# Altium schematic sheet 8500_ADC_Y.SchDoc
size A4
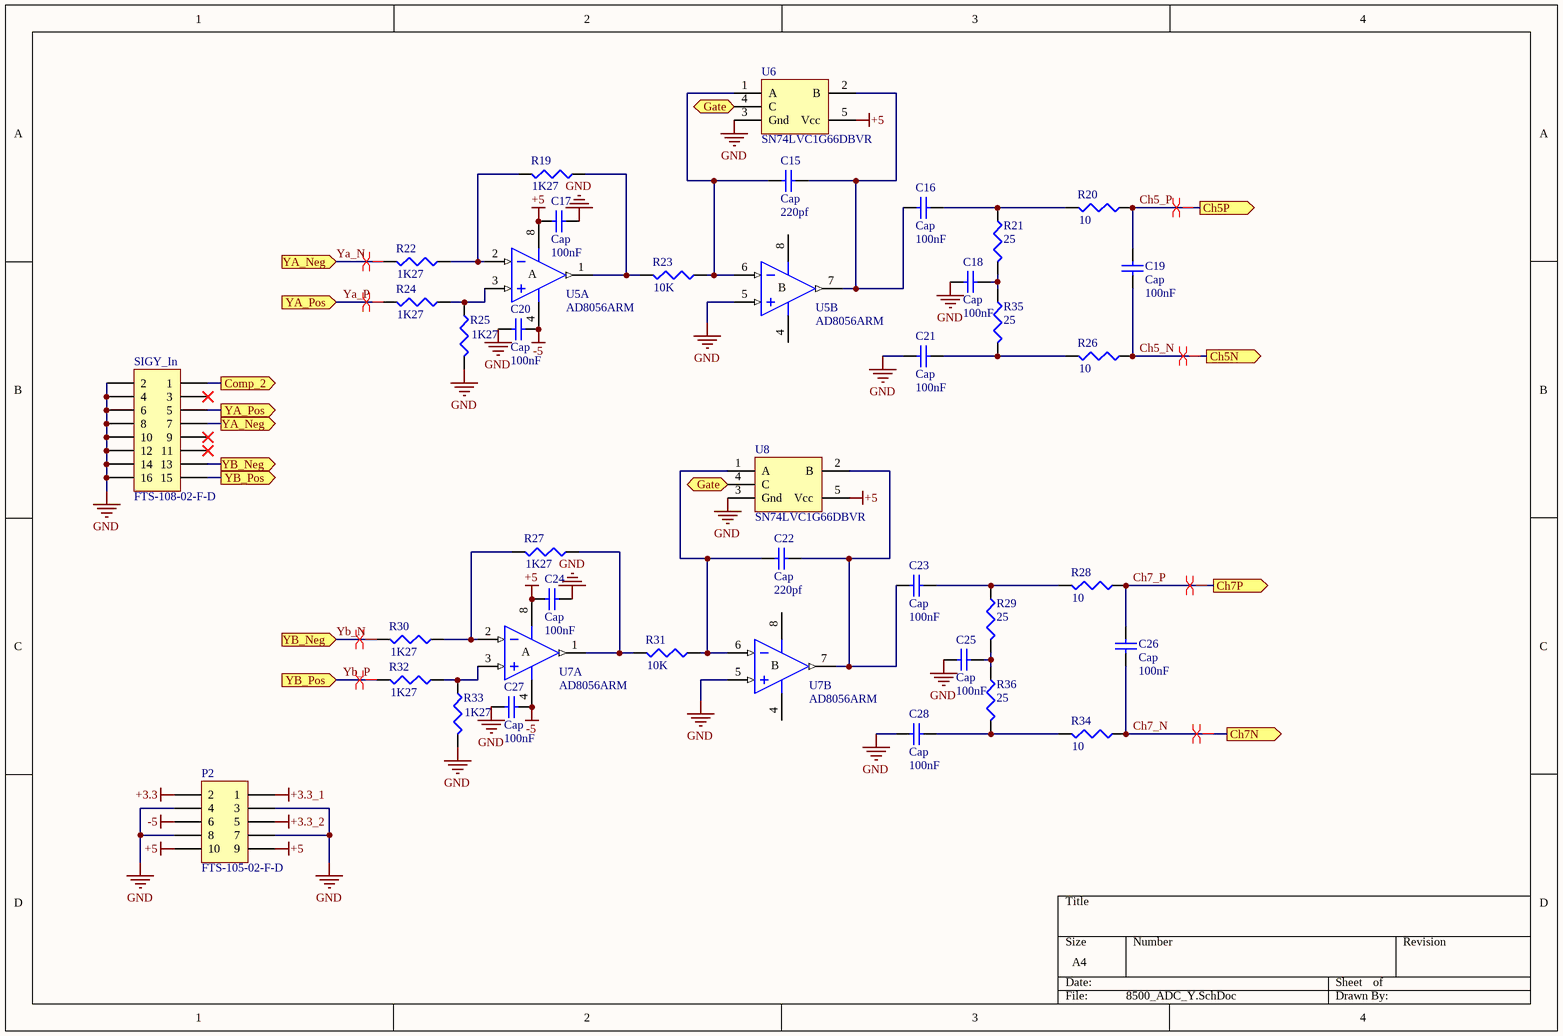
[diagram p0: 8500_ADC_Y.SchDoc]

## Parts
C15  Cap  value 220pf  [0402]
C16  Cap  value 100nF  [0402]
C17  Cap  value 100nF  [0402]
C18  Cap  value 100nF  [0402]
C19  Cap  value 100nF  [0402]
C20  Cap  value 100nF  [0402]
C21  Cap  value 100nF  [0402]
C22  Cap  value 220pf  [0402]
C23  Cap  value 100nF  [0402]
C24  Cap  value 100nF  [0402]
C25  Cap  value 100nF  [0402]
C26  Cap  value 100nF  [0402]
C27  Cap  value 100nF  [0402]
C28  Cap  value 100nF  [0402]
P2  FTS-105-02-F-D  [MHDR2X5]
R19  value 1K27  [0402]  (hidden comment: Res3)
R20  value 10  [0402]  (hidden comment: Res3)
R21  value 25  [0402]  (hidden comment: Res3)
R22  value 1K27  [0402]  (hidden comment: Res3)
R23  value 10K  [0402]  (hidden comment: Res3)
R24  value 1K27  [0402]  (hidden comment: Res3)
R25  value 1K27  [0402]  (hidden comment: Res3)
R26  value 10  [0402]  (hidden comment: Res3)
R27  value 1K27  [0402]  (hidden comment: Res3)
R28  value 10  [0402]  (hidden comment: Res3)
R29  value 25  [0402]  (hidden comment: Res3)
R30  value 1K27  [0402]  (hidden comment: Res3)
R31  value 10K  [0402]  (hidden comment: Res3)
R32  value 1K27  [0402]  (hidden comment: Res3)
R33  value 1K27  [0402]  (hidden comment: Res3)
R34  value 10  [0402]  (hidden comment: Res3)
R35  value 25  [0402]  (hidden comment: Res3)
R36  value 25  [0402]  (hidden comment: Res3)
SIGY_In  FTS-108-02-F-D  [MHDR2X8]
U5  AD8056ARM  [RM-8]  (parts A,B of 2)
U6  SN74LVC1G66DBVR  [SOT23-5]
U7  AD8056ARM  [RM-8]  (parts A,B of 2)
U8  SN74LVC1G66DBVR  [SOT23-5]

## Ports
Ch5N (out), Ch5P (out), Ch7N (out), Ch7P (out), Comp_2 (out), Gate (out), YA_Neg (in), YA_Neg (out), YA_Pos (in), YA_Pos (out), YB_Neg (in), YB_Neg (out), YB_Pos (in), YB_Pos (out)

## Nets
+3.3: P2.2
+3.3_1: P2.1
+3.3_2: P2.5
+5: C17.1 C24.1 P2.9 P2.10 U5.8(V+) U6.5(Vcc) U7.8(V+) U8.5(Vcc)
-5: C20.2 C27.2 P2.6 U5.4(V-) U7.4(V-)
GND: C17.2 C18.1 C20.1 C21.1 C24.2 C25.1 C27.1 C28.1 P2.3 P2.4 P2.7 P2.8 R25.2 R33.2 SIGY_In.2 SIGY_In.4 SIGY_In.6 SIGY_In.8 SIGY_In.10 SIGY_In.12 SIGY_In.14 SIGY_In.16 U5.5(IN+) U6.3(Gnd) U7.5(IN+) U8.3(Gnd)
Ch5_N: C19.1 R26.1 ; port Ch5N
Ch5_P: C19.2 R20.1 ; port Ch5P
Ch7_N: C26.1 R34.1 ; port Ch7N
Ch7_P: C26.2 R28.1 ; port Ch7P
Comp_2: SIGY_In.1 ; port Comp_2
Gate: U6.4(C) U8.4(C) ; port Gate
Ya_N: R22.2 SIGY_In.7 ; port YA_Neg
Ya_P: R24.2 SIGY_In.5 ; port YA_Pos
Yb_N: R30.2 SIGY_In.13 ; port YB_Neg
Yb_P: R32.2 SIGY_In.15 ; port YB_Pos
NetC15_1: C15.1 R23.1 U5.6(IN-) U6.1(A)
NetC15_2: C15.2 C16.1 U5.7(OUT) U6.2(B)
NetC16_2: C16.2 R20.2 R21.1
NetC18_2: C18.2 R21.2 R35.1
NetC21_2: C21.2 R26.2 R35.2
NetC22_1: C22.1 R31.1 U7.6(IN-) U8.1(A)
NetC22_2: C22.2 C23.1 U7.7(OUT) U8.2(B)
NetC23_2: C23.2 R28.2 R29.1
NetC25_2: C25.2 R29.2 R36.1
NetC28_2: C28.2 R34.2 R36.2
NetR19_1: R19.1 R23.2 U5.1(OUT)
NetR19_2: R19.2 R22.1 U5.2(IN-)
NetR24_1: R24.1 R25.1 U5.3(IN+)
NetR27_1: R27.1 R31.2 U7.1(OUT)
NetR27_2: R27.2 R30.1 U7.2(IN-)
NetR32_1: R32.1 R33.1 U7.3(IN+)

Not connected (* = marked no-connect by the designer): SIGY_In 3* 9* 11*

## Layout directives
differential pair: Ch5_N, Ch5_P, Ch7_N, Ch7_P, Ya_N, Ya_P, Yb_N, Yb_P

## Notes on the sheet
- (in symbol AD8056ARM, part A) A
- (in symbol AD8056ARM, part B) B

## Library data of the parts
C15-C28 = Cap: Capacitor; Published: 8-Jun-2000; LatestRevisionDate: 17-Jul-2002; LatestRevisionNote: Re-released for DXP Platform.; PackageReference: RAD-0.3; Publisher: Altium Limited; PackageDescription: Radial Cap, Thru-Hole; 2 Leads; 0.3 in Pin Spacing
P2 = FTR-105-01-D
R19-R36 = Res3: Resistor; Published: 8-Jun-2000; LatestRevisionDate: 29-May-2009; LatestRevisionNote: IPC-7351 Footprint Added.; PackageReference: J1-0603; Publisher: Altium Limited; PackageDescription: Chip Resistor
SIGY_In = FTR-108-01-D
U5 U7 = AD8056ARM: Low Cost, 300MHz Voltage Feedback Amplifier; Published: 8-Jun-2000; LatestRevisionDate: 04-Mar-2005; LatestRevisionNote: Stylized 3D Model Added, PCB footprint pad width decreased.; DatasheetVersion: REV. 0 1997; PackageVersion: 2004; PackageReference: RM-8; Publisher: Altium Limited; PackageDescription: Shrink Small Outline, MSOP; 8 Leads; Body Width 3 mm; Pitch 0.65 mm; Code_JEDEC: MO-187-AA; ComponentLink1Description: Manufacturer Link; ComponentLink1URL: http://www.analog.com/en/prod/0,,759_786_AD8055%2C00.html; ComponentLink2Description: Datasheet; ComponentLink2URL: http://www.analog.com/UploadedFiles/Data_Sheets/40402558757264AD8055_6_i.pdf